# EAGLE schematic ECG_Patch (EAGLE 6.4)
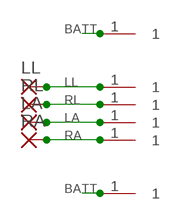
[diagram p0: schematic, sheet 1]

## Parts
LA  1,6/0,8  [1,6/0,8]
LL  1,6/0,8  [1,6/0,8]
P1  PISTON_RA_TH  [PISTON_RA_TH]
P2  PISTON_RA_TH  [PISTON_RA_TH]
P3  PISTON_RA_TH  [PISTON_RA_TH]
P4  PISTON_RA_TH  [PISTON_RA_TH]
P5  PISTON_RA_TH  [PISTON_RA_TH]
P6  PISTON_RA_TH  [PISTON_RA_TH]
RA  1,6/0,8  [1,6/0,8]
RL  1,6/0,8  [1,6/0,8]

## Nets
BATT: P1.1 P6.1
LA: LA.1(P) P4.1
LL: LL.1(P) P3.1
RA: P5.1 RA.1(P)
RL: P2.1 RL.1(P)

## Library data of the parts
LA LL RA RL = wirepad:1,6/0,8: THROUGH-HOLE PAD
P1-P6 = pins:PISTON_RA_TH